# Altium schematic sheet Display.SchDoc
size A4; SheetNumber: 2; SheetTotal: 5
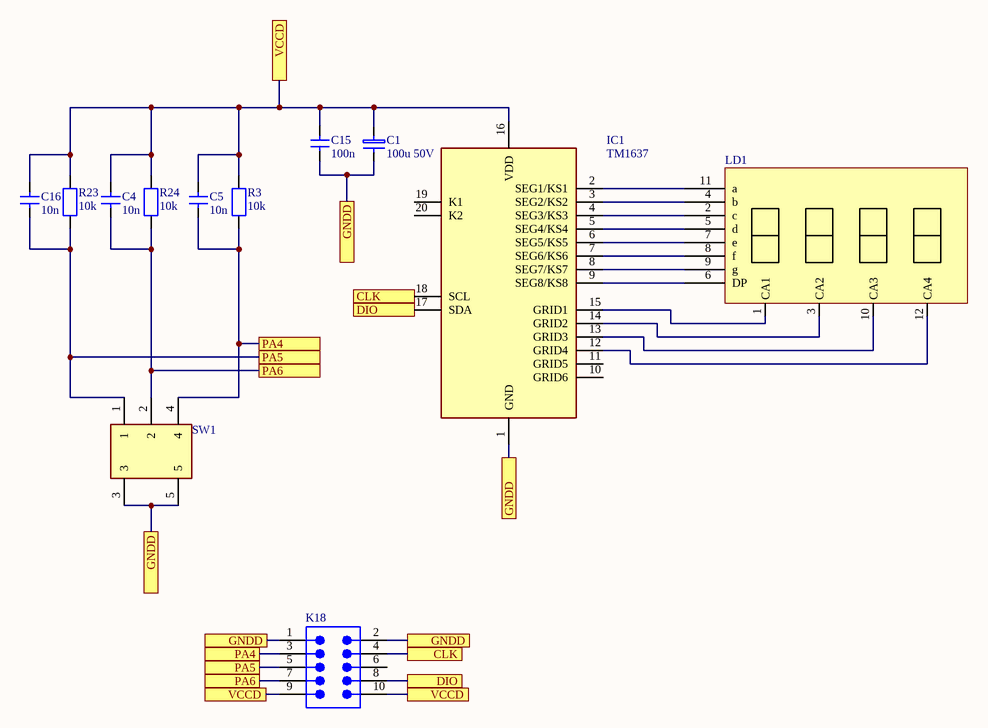
[diagram p0: Display.SchDoc]

## Parts
C1  100u 50V  [CAPACITOR100UF]
C4  10n  [CAPACITOR10NF]
C5  10n  [CAPACITOR10NF]
C15  100n  [Capacitor100nf]
C16  10n  [CAPACITOR10NF]
IC1  TM1637  [TM1637]
K18  61231020621  [[10][2]Pinheader]  (value not drawn)
LD1  (no value)  [7segment]
R3  10k  [Resistor]
R23  10k  [Resistor]
R24  10k  [Resistor]
SW1  (no value)  [Encoder]

## Ports
CLK (see Display[2B]), CLK (see Display[2D]), DIO (see Display[2B]), DIO (see Display[2D]), GNDD (see Display[1C], Display[2B], Display[2C], Display[2D]), GNDD (see Display[1C], Display[2B], Display[2D]), GNDD (see Display[1C], Display[2C], Display[2D]), GNDD (see Display[2B], Display[2C], Display[2D]), PA4 (see Display[2B]), PA4 (see Display[2D]), PA5 (see Display[2B]), PA5 (see Display[2D]), PA6 (see Display[2B]), PA6 (see Display[2D]), VCCD (see Display[2A], Display[2D]), VCCD (see Display[2D])

## Nets
CLK: IC1.18(SCL) K18.4 ; port CLK
DIO: IC1.17(SDA) K18.8 ; port DIO
GNDD: C1.2 C15.1 IC1.1(GND) K18.1 K18.2 SW1.3 SW1.5 ; port GNDD
PA4: C5.1 K18.3 R3.1 SW1.4 ; port PA4
PA5: C16.1 K18.5 R23.1 SW1.1 ; port PA5
PA6: C4.1 K18.7 R24.1 SW1.2 ; port PA6
VCCD: C1.1 C4.2 C5.2 C15.2 C16.2 IC1.16(VDD) K18.9 K18.10 R3.2 R23.2 R24.2 ; port VCCD
NetIC1_2: IC1.2(SEG1/KS1) LD1.11(a)
NetIC1_3: IC1.3(SEG2/KS2) LD1.4(b)
NetIC1_4: IC1.4(SEG3/KS3) LD1.2(c)
NetIC1_5: IC1.5(SEG4/KS4) LD1.5(d)
NetIC1_6: IC1.6(SEG5/KS5) LD1.7(e)
NetIC1_7: IC1.7(SEG6/KS6) LD1.8(f)
NetIC1_8: IC1.8(SEG7/KS7) LD1.9(g)
NetIC1_9: IC1.9(SEG8/KS8) LD1.6(DP)
NetIC1_12: IC1.12(GRID4) LD1.12(CA4)
NetIC1_13: IC1.13(GRID3) LD1.10(CA3)
NetIC1_14: IC1.14(GRID2) LD1.3(CA2)
NetIC1_15: IC1.15(GRID1) LD1.1(CA1)

Not connected (* = marked no-connect by the designer): IC1 10(GRID6) 11(GRID5) 19(K1) 20(K2); K18 6

## Library data of the parts
C1 = CapacitorPol: 860010683032 WCAP-ATG8 Aluminum Electrolytic Capacitors; NexarPartId: 53914131; Pitch: 10mm; Capacitance: 4.7mF; Tolerance: 20%; Polarity: Polar; Ripple Current: 3.355A; Life (Hours): 2000hours; Leakage Current: 2.35mA; Mount: Through Hole; REACH SVHC: Unknown; Voltage Rating (DC): 50V; Voltage Rating: 50V; Case/Package: Radial; Height - Seated (Max): 43.0022mm; Length: 41mm; Lead Pitch: 10.0076mm; Height: 41mm; Diameter: 22mm; RoHS: Compliant; Max Operating Temperature: 85°C; Min Operating Temperature: -40°C
C4 C5 C15 C16 = Capacitor: CAP CER 10000PF 50V X7R 0805; NexarPartId: 65419863; Capacitance: 10nF; Tolerance: 10%; Material: Ceramic; Insulation Resistance: 10GΩ; Case Code (Metric): 2012; Voltage Rating (DC): 50V; Height: 800µm; REACH SVHC: Unknown; Length: 2mm; Case/Package: 0805; RoHS: Compliant; Dielectric: X7R; Packaging: Tape & Reel (TR); Mount: Surface Mount; Max Operating Temperature: 125°C; Thickness: 889µm; Voltage Rating: 50V; Width: 1.25mm; Case Code (Imperial): 0805; Min Operating Temperature: -55°C
IC1 = TM1637: LED Drive Control Special Circuit; MF: Titan Micro Electronics; Package: Package; Availability: Not in stock; SnapEDA_Link: https://www.snapeda.com/parts/TM1637/Titan+Micro+Electronics/view-part/?ref=snap; MP: TM1637; Check_prices: https://www.snapeda.com/parts/TM1637/Titan+Micro+Electronics/view-part/?ref=eda; Value: *; Price: None
K18 = [10][2]Pinheader: NexarPartId: 32855511; Gender: Male; Pitch: 2.54mm; Number of Contacts: 10; Insulation Resistance: 1GΩ; Current Rating: 3A; Connector Type: Male Pin; Operating Supply Voltage: 250V; Contact Resistance: 20mΩ; Contact Mating Length: 5.0038mm; Number of Pins: 10; Color: Black; Number of Rows: 2; RoHS: Compliant; Row Spacing: 2.54mm; Orientation: Vertical; Packaging: Tape and Reel; Length: 18.02mm; Number of Positions: 10; Contact Material: Copper; Termination: Solder; Contact Plating: Gold; Mount: Surface Mount; Lead Pitch: 2.54mm; REACH SVHC: Unknown; Max Operating Temperature: 125°C; Min Operating Temperature: -40°C
LD1 = 7segment
R3 R23 R24 = Resistor: Manufacturer: Vishay Dale; Part Number: CRCW08050000Z0EA
SW1 = Encoder: Undefined or Miscellaneous; Manufacturer_Name: Bourns; Manufacturer_Part_Number: PEC11R-4225F-S0024; Datasheet Link: https://componentsearchengine.com//PEC11R-4225F-S0024.pdf; Mouser2 Part Number: 652-PEC11R-4225F-S24; Mouser2 Price/Stock: https://www.mouser.com/Search/Refine.aspx?Keyword=652-PEC11R-4225F-S24